# EAGLE design SKAARDUINO-SER_v1.0 (EAGLE 7.5.0)

## Sheet 1 of 2
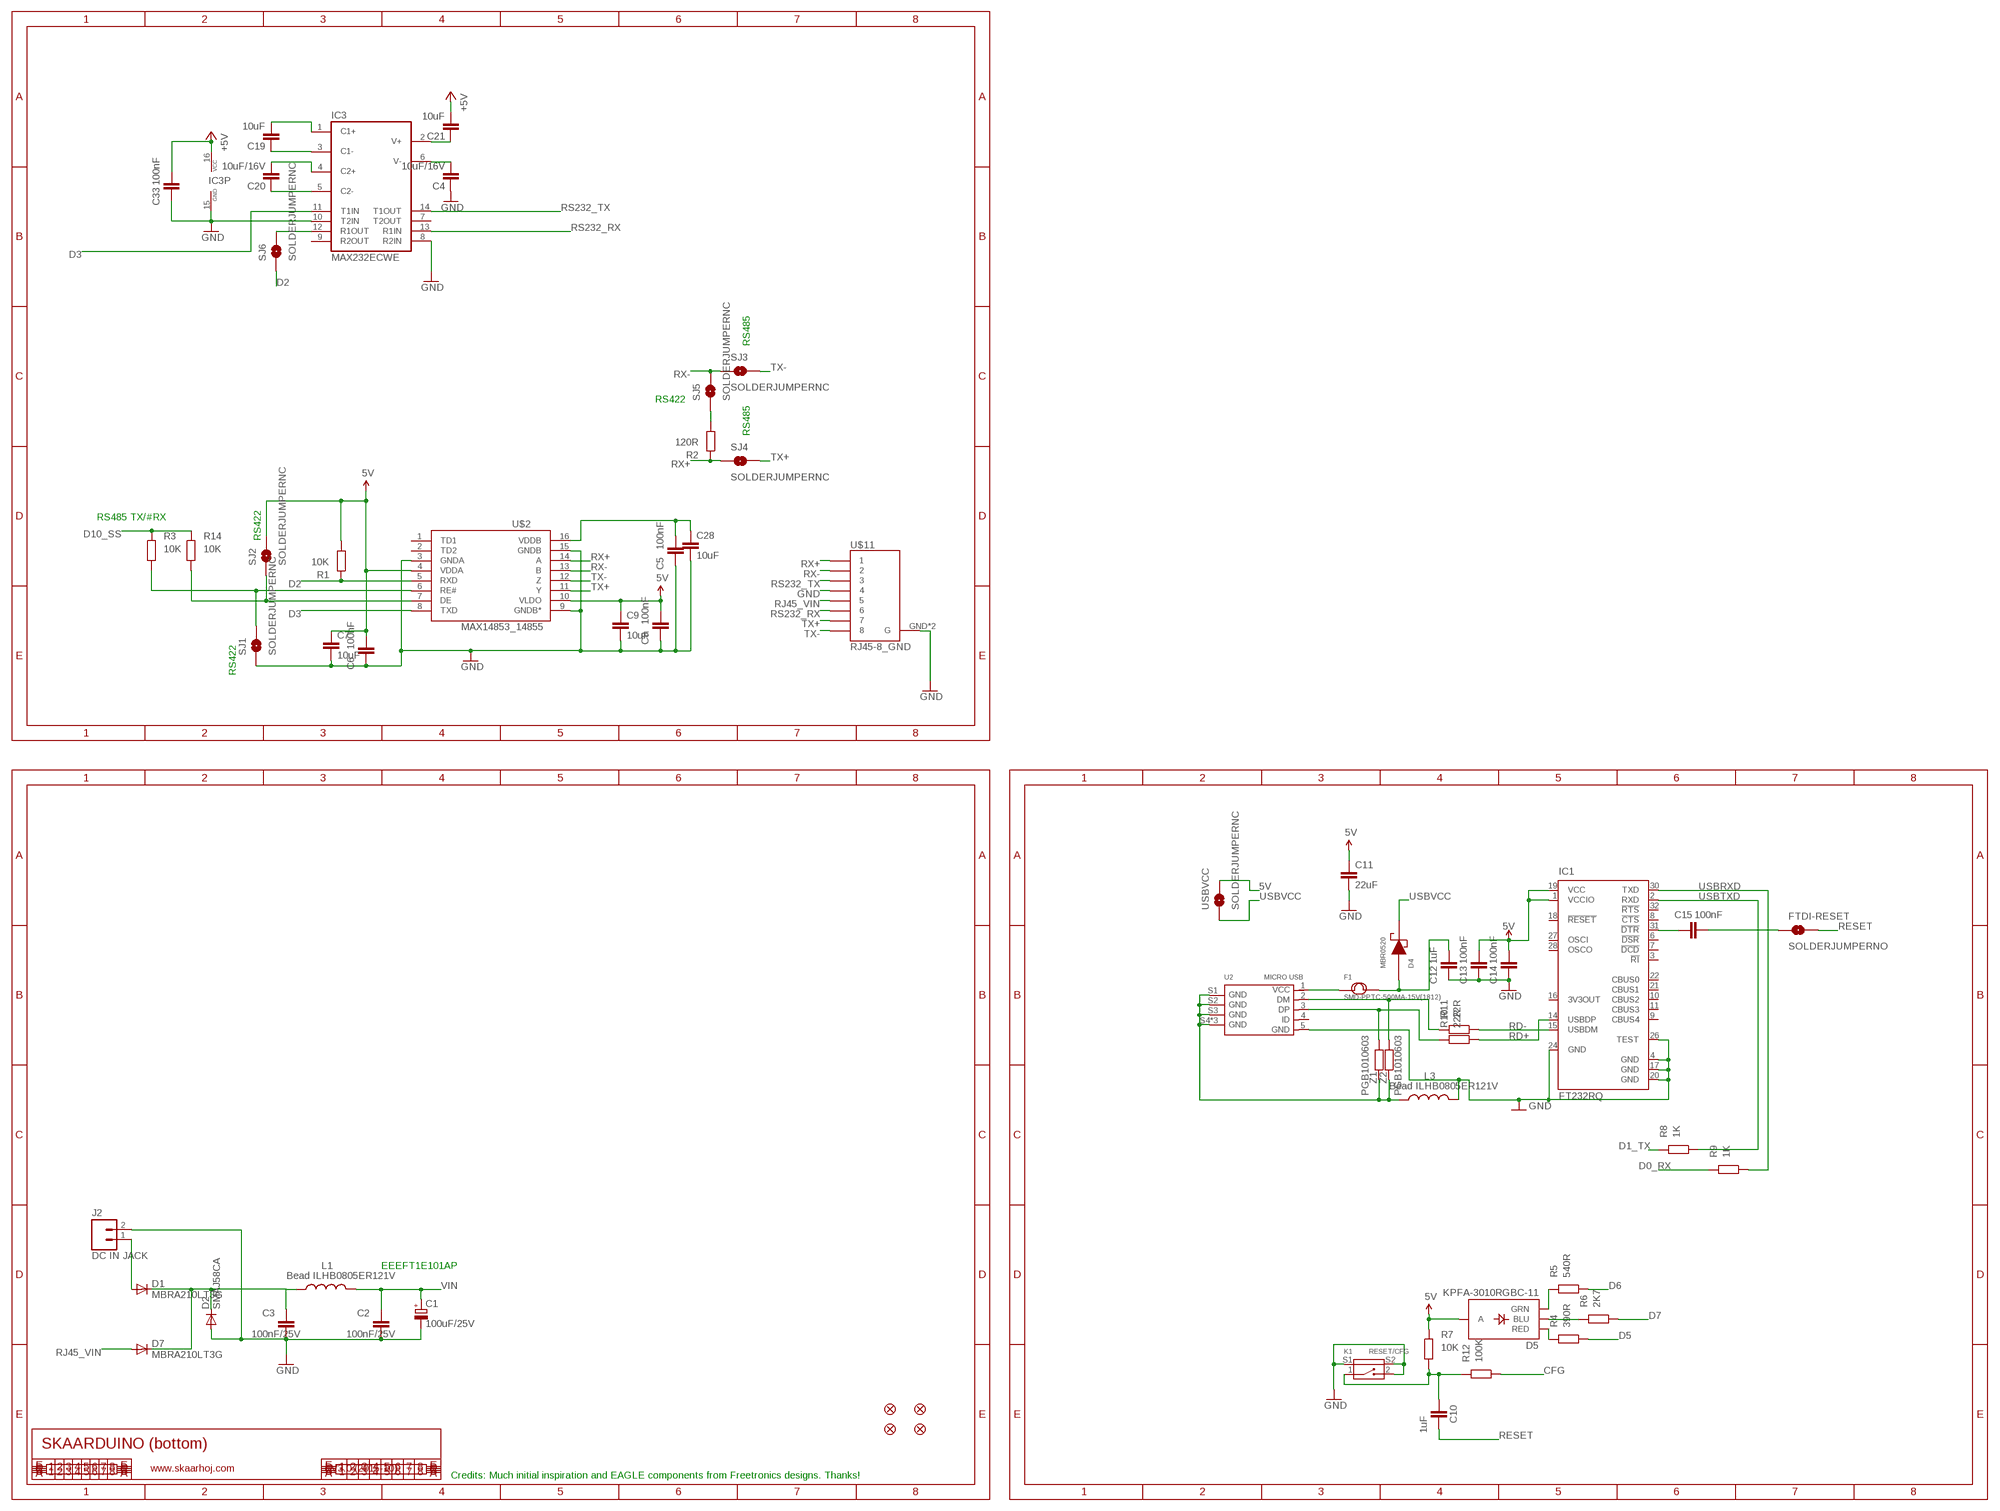
[diagram p0: schematic, sheet 1]

### Parts
C1  100uF/25V  CPOL-EUD  [PANASONIC_D]
C2  100nF/25V  CAP0402  [C0402]
C3  100nF/25V  CAP0402  [C0402]
C4  10uF/16V  CAP0805  [0805]
C5  100nF  C-EU0402C  [0402C]
C6  100nF  C-EU0402C  [0402C]
C7  10uF  CAP0805  [0805]
C8  100nF  C-EU0402C  [0402C]
C9  10uF  CAP0805  [0805]
C10  1uF  C-EU0402C  [0402C]
C11  22uF  CAP0805  [0805]
C12  1uF  C-EU0402C  [0402C]
C13  100nF  C-EU0402C  [0402C]
C14  100nF  C-EU0402C  [0402C]
C15  100nF  C-EU0402C  [0402C]
C19  10uF  CAP0805  [0805]
C20  10uF/16V  CAP0805  [0805]
C21  10uF  CAP0805  [0805]
C28  10uF  CAP0805  [0805]
C33  100nF  C-EU0402C  [0402C]
D1  MBRA210LT3G  DIODESMA  [SMA-DIODE]
D2  SMAJ58CA  DIODESMA  [SMA-DIODE]
D4  MBR0520  [SOD-123]
D5  KPFA-3010RGBC-11  LED-TRICOLOR  [LED-TRICOLOR-SMD]
D7  MBRA210LT3G  DIODESMA  [SMA-DIODE]
F1  SMD-PPTC-500MA-15V(1812)  [F1812]
FID1  FIDUCIAL1X2.5  [FIDUCIAL-1X2.5]
FID2  FIDUCIAL1X2.5  [FIDUCIAL-1X2.5]
FID3  FIDUCIAL1X2.5  [FIDUCIAL-1X2.5]
FID4  FIDUCIAL1X2.5  [FIDUCIAL-1X2.5]
FTDI-RESET  SOLDERJUMPERNO  [SJ_2S-NO]
IC1  FT232RQ  [QFN32]
IC3  MAX232ECWE  [SO16L]
J2  DC IN JACK  M02PTH  [1X02]
K1  RESET/CFG  SMD-BUTTON-2+2P  [SW4-SMD-7.0X3.5X3.5MM-90D]
L1  Bead ILHB0805ER121V  L-USL2012C  [L2012C]
L3  Bead ILHB0805ER121V  L-USL2012C  [L2012C]
R1  10K  RESISTOR0402  [0402]
R2  120R  RESISTOR0402  [0402]
R3  10K  RESISTOR0402  [0402]
R4  390R  RESISTOR0402  [0402]
R5  540R  RESISTOR0402  [0402]
R6  2K7  RESISTOR0402  [0402]
R7  10K  RESISTOR0402  [0402]
R8  1K  RESISTOR0402  [0402]
R9  1K  RESISTOR0402  [0402]
R10  22R  RESISTOR0402  [0402]
R11  22R  RESISTOR0402  [0402]
R12  100K  RESISTOR0402  [0402]
R14  10K  RESISTOR0402  [0402]
SJ1  SOLDERJUMPERNC  [SJ_2S]
SJ2  SOLDERJUMPERNC  [SJ_2S]
SJ3  SOLDERJUMPERNC  [SJ_2S]
SJ4  SOLDERJUMPERNC  [SJ_2S]
SJ5  SOLDERJUMPERNC  [SJ_2S]
SJ6  SOLDERJUMPERNC  [SJ_2S]
U2  MICRO USB  MICRO-USB-SMD-B-WITHOUT-POST-W/P(ST-USB-001G)  [MICRO-USB5+4P-SMD-0.65-B]
U$2  MAX14853_14855  [SO-16W]
U$11  RJ45-8_GND  [RJ45-8_GND]
USBVCC  SOLDERJUMPERNC  [SJ_2S]
Z1  PGB1010603  RESISTOR0402  [C0402]
Z2  PGB1010603  RESISTOR0402  [C0402]

### Nets
5V [power]: C6.2 C7.1 C8.2 C9.1 C11.1 C13.2 C14.2 C21.2 C33.2 D5.A IC1.1(VCCIO) IC1.19(VCC) IC3.16(VCC) R1.1 R7.2 SJ2.2 U$2.4(VDDA) U$2.10(VLDO) USBVCC.2 ; supply symbol labelled +5V ; also sheet 2
CFG: R12.1 ; also sheet 2
CFGSW: C10.2 K1.1 R7.1 R12.2
D0_RX: R9.2 ; also sheet 2
D1_TX: R8.2 ; also sheet 2
D2: R1.2 SJ6.1 U$2.5(RXD) ; also sheet 2
D3: IC3.11(T1IN) U$2.8(TXD) ; also sheet 2
D5: R4.1 ; also sheet 2
D6: R5.1 ; also sheet 2
D7: R6.1 ; also sheet 2
D10_SS: R3.2 R14.2 ; also sheet 2
GND [power]: C1.- C2.2 C3.2 C4.1 C5.1 C6.1 C7.2 C8.1 C9.2 C11.2 C12.1 C13.1 C14.1 C28.2 C33.1 D2.A IC1.4(GND) IC1.17(GND) IC1.20(GND) IC1.24(GND) IC1.26(TEST) IC3.8(R2IN) IC3.10(T2IN) IC3.15(GND) J2.2 K1.2 K1.S1 K1.S2 L3.2 SJ1.1 U2.5(GND) U$2.3(GNDA) U$2.9(GNDB*) U$2.15(GNDB) U$11.4 U$11.GND1(G) U$11.GND(G) ; also sheet 2
MAX232_V+ [power]: C21.1 IC3.2(V+)
N$1: C19.1 IC3.3(C1-)
N$2: C15.2 FTDI-RESET.1
N$3: D5.B(BLU) R6.2
N$4 [VIN]: C3.1 D1.C D2.C D7.C L1.1
N$5: D5.G(GRN) R5.2
N$6 [VIN]: C12.2 D4.2(AN) F1.2
N$7 [VIN]: F1.1 U2.1(VCC)
N$9: C20.1 IC3.5(C2-)
N$11: C20.2 IC3.4(C2+)
N$13 [VIN]: D1.A J2.1
N$15: D5.R(RED) R4.2
N$16: R10.2 U2.3(DP) Z1.1
N$17: R11.2 U2.2(DM) Z2.1
N$18: C15.1 IC1.31(!DTR)
N$20: IC3.12(R1OUT) SJ6.2
N$21: L3.1 U2.S1(GND) U2.S2(GND) U2.S3(GND) U2.S4(GND) U2.S5(GND) U2.S6(GND) Z1.2 Z2.2
N$30: R2.1 SJ5.1
N$31: R14.1 SJ2.1 U$2.7(DE)
N$32: R3.1 SJ1.2 U$2.6(RE#)
N$35: C5.2 C28.1 U$2.16(VDDB)
N$47: C19.2 IC3.1(C1+)
N$49 [power]: C4.2 IC3.6(V-)
RD+: IC1.14(USBDP) R10.1
RD-: IC1.15(USBDM) R11.1
RESET: C10.1 FTDI-RESET.2 ; also sheet 2
RJ45_VIN: D7.A U$11.5
RS232_RX: IC3.13(R1IN) U$11.6
RS232_TX: IC3.14(T1OUT) U$11.3
RX+: R2.2 SJ4.1 U$2.14(A) U$11.1
RX-: SJ3.1 SJ5.2 U$2.13(B) U$11.2
TX+: SJ4.2 U$2.11(Y) U$11.7
TX-: SJ3.2 U$2.12(Z) U$11.8
USBRXD: IC1.30(TXD) R9.1
USBTXD: IC1.2(RXD) R8.1
USBVCC [VIN]: D4.1(CA) USBVCC.1
VIN [VIN]: C1.+ C2.1 L1.2 ; also sheet 2
Unconnected: IC1.3(!RI) IC1.6(!DSR) IC1.7(!DCD) IC1.8(!CTS) IC1.9(CBUS4) IC1.10(CBUS2) IC1.11(CBUS3) IC1.16(3V3OUT) IC1.18(!RESET) IC1.21(CBUS1) IC1.22(CBUS0) IC1.27(OSCI) IC1.28(OSCO) IC1.32(!RTS) IC3.7(T2OUT) IC3.9(R2OUT) U2.4(ID) U$2.1(TD1) U$2.2(TD2)

### Notes on the sheet
- RS485
- RS422
- RS485
- RS485 TX/#RX
- RS422
- RS422
- EEEFT1E101AP
- SKAARDUINO (bottom)
- www.skaarhoj.com | V3.0 (2015-10)
- Credits: Much initial inspiration and EAGLE components from Freetronics designs. Thanks!

## Sheet 2 of 2
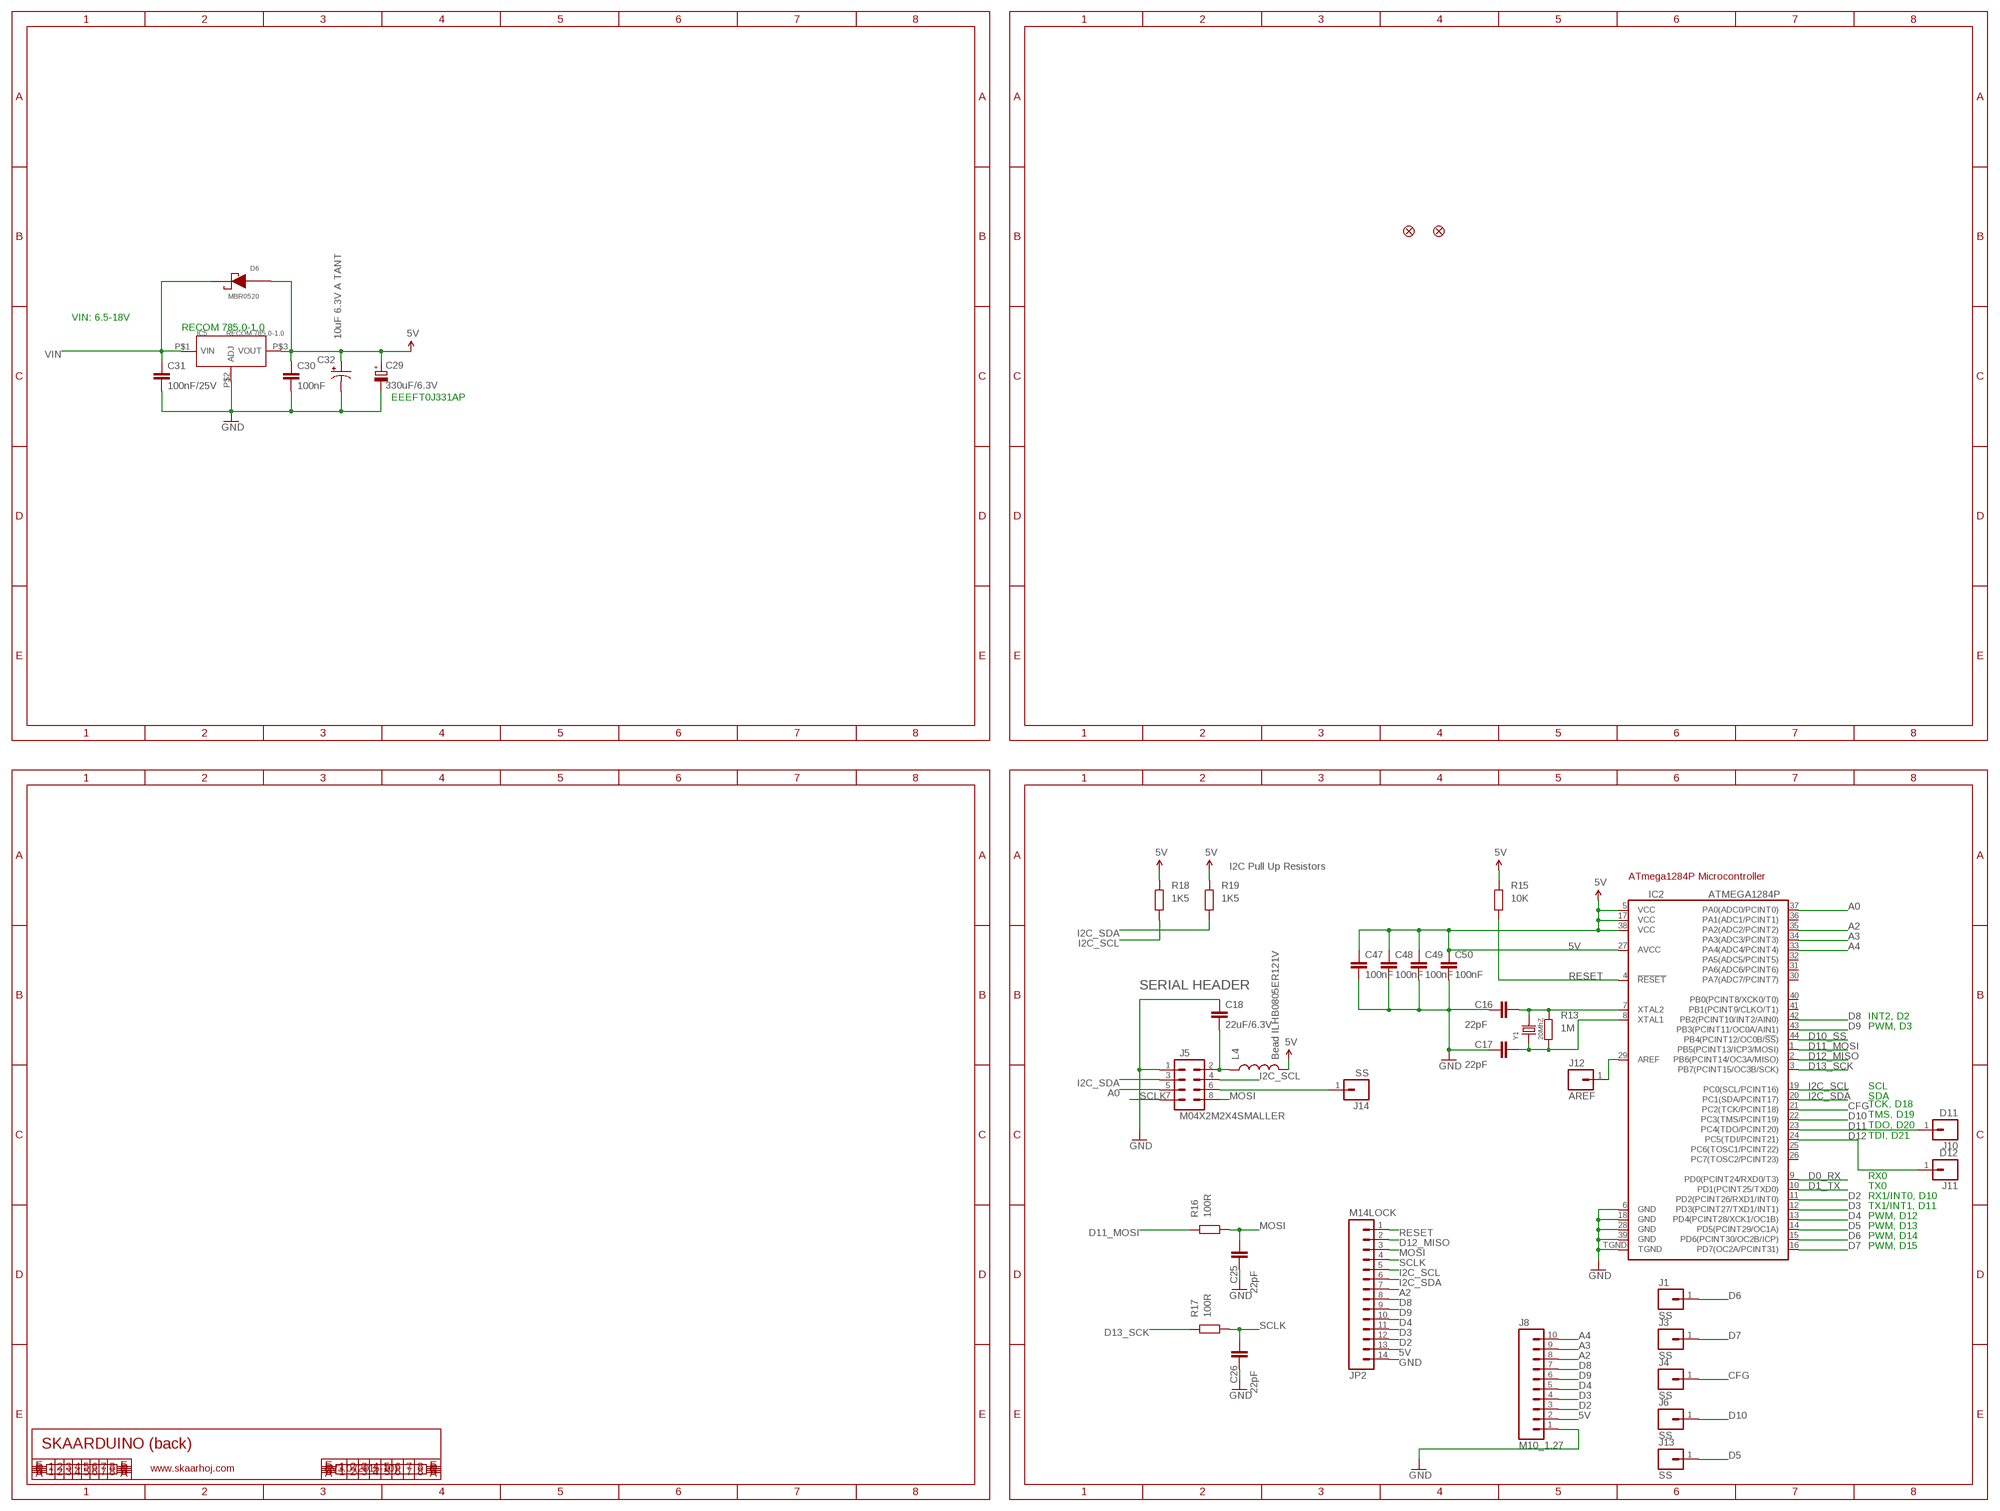
[diagram p1: schematic, sheet 2]

### Parts
C16  22pF  C-EU0402C  [0402C]
C17  22pF  C-EU0402C  [0402C]
C18  22uF/6.3V  CAP0805  [0805]
C25  22pF  C-EU0402C  [0402C]
C26  22pF  C-EU0402C  [0402C]
C29  330uF/6.3V  CPOL-EUD  [PANASONIC_D]
C30  100nF  C-EU0402C  [0402C]
C31  100nF/25V  C-EU0402C  [0402C]
C32  10uF 6.3V A TANT  CAP_POL1206  [EIA3216]
C47  100nF  C-EU0402C  [0402C]
C48  100nF  C-EU0402C  [0402C]
C49  100nF  C-EU0402C  [0402C]
C50  100nF  C-EU0402C  [0402C]
D6  MBR0520  [SOD-123]
FID5  FIDUCIAL1X2.5  [FIDUCIAL-1X2.5]
FID8  FIDUCIAL1X2.5  [FIDUCIAL-1X2.5]
IC2  ATMEGA1284P  [QFN-44M1]
IC5  RECOM 785.0-1.0  PMIC-LM317EMP  [RECOM_785.0-1.0]
J1  SS  M1X1TEST  [M1X1]
J3  SS  M1X1TEST  [M1X1]
J4  SS  M1X1TEST  [M1X1]
J5  M04X2M2X4SMALLER  [M2X4SMALLER]
J6  SS  M1X1TEST  [M1X1]
J8  M10_1.27  [M10X1]
J10  D11  M1X1TEST  [M1X1]
J11  D12  M1X1TEST  [M1X1]
J12  AREF  M1X1TEST  [M1X1]
J13  SS  M1X1TEST  [M1X1]
J14  SS  M1X1TEST  [M1X1]
JP2  M14LOCK  [1X14_LOCK]
L4  Bead ILHB0805ER121V  INDUCTOR0805  [0805]
R13  1M  RESISTOR0402  [0402]
R15  10K  RESISTOR0402  [0402]
R16  100R  RESISTOR0402  [0402]
R17  100R  RESISTOR0402  [0402]
R18  1K5  RESISTOR0402  [0402]
R19  1K5  RESISTOR0402  [0402]
Y1  20MhZ  SMD-CRYSTAL-16MHZ-8PF-20PPM-40R(2P-5.0X3.2MM)  [X2-SMD-5.0X3.2X1.3MM]

### Nets
5V [power]: C29.+ C30.1 C32.A(+) C47.1 C48.1 C49.1 C50.1 D6.2(AN) IC2.5(VCC) IC2.17(VCC) IC2.27(AVCC) IC2.38(VCC) IC5.P$3(VOUT) J8.2 JP2.13 L4.2 R15.2 R18.2 R19.2 ; also sheet 1
A0: IC2.37(PA0(ADC0/PCINT0)) J5.5
A2: IC2.35(PA2(ADC2/PCINT2)) J8.8 JP2.7
A3: IC2.34(PA3(ADC3/PCINT3)) J8.9
A4: IC2.33(PA4(ADC4/PCINT4)) J8.10
CFG: IC2.21(PC2(TCK/PCINT18)) J4.1 ; also sheet 1
D0_RX: IC2.9(PD0(PCINT24/RXD0/T3)) ; also sheet 1
D1_TX: IC2.10(PD1(PCINT25/TXD0)) ; also sheet 1
D2: IC2.11(PD2(PCINT26/RXD1/INT0)) J8.3 JP2.12 ; also sheet 1
D3: IC2.12(PD3(PCINT27/TXD1/INT1)) J8.4 JP2.11 ; also sheet 1
D4: IC2.13(PD4(PCINT28/XCK1/OC1B)) J8.5 JP2.10
D5: IC2.14(PD5(PCINT29/OC1A)) J13.1 ; also sheet 1
D6: IC2.15(PD6(PCINT30/OC2B/ICP)) J1.1 ; also sheet 1
D7: IC2.16(PD7(OC2A/PCINT31)) J3.1 ; also sheet 1
D8: IC2.42(PB2(PCINT10/INT2/AIN0)) J8.7 JP2.8
D9: IC2.43(PB3(PCINT11/OC0A/AIN1)) J8.6 JP2.9
D10: IC2.22(PC3(TMS/PCINT19)) J6.1
D10_SS: IC2.44(PB4(PCINT12/OC0B/!SS!)) ; also sheet 1
D11: IC2.23(PC4(TDO/PCINT20)) J10.1
D11_MOSI: IC2.1(PB5(PCINT13/ICP3/MOSI)) R16.2
D12: IC2.24(PC5(TDI/PCINT21)) J11.1
D12_MISO: IC2.2(PB6(PCINT14/OC3A/MISO)) JP2.2
D13_SCK: IC2.3(PB7(PCINT15/OC3B/SCK)) R17.2
GND [power]: C16.1 C17.1 C18.1 C25.1 C26.1 C29.- C30.2 C31.2 C32.C(-) C47.2 C48.2 C49.2 C50.2 IC2.6(GND) IC2.18(GND) IC2.28(GND) IC2.39(GND) IC2.TGND IC5.P$2(ADJ) J5.1 J8.1 JP2.14 ; also sheet 1
I2C_SCL: IC2.19(PC0(SCL/PCINT16)) J5.4 JP2.5 R18.1
I2C_SDA: IC2.20(PC1(SDA/PCINT17)) J5.3 JP2.6 R19.1
MOSI: C25.2 J5.8 JP2.3 R16.1
N$8: C16.2 IC2.7(XTAL2) R13.2 Y1.2
N$10: J5.6 J14.1
N$12: C17.2 IC2.8(XTAL1) R13.1 Y1.1
N$19 [power]: C18.2 J5.2 L4.1
N$25: IC2.29(AREF) J12.1
RESET: IC2.4(!RESET) JP2.1 R15.1 ; also sheet 1
SCLK: C26.2 J5.7 JP2.4 R17.1
VIN [VIN]: C31.1 D6.1(CA) IC5.P$1(VIN) ; also sheet 1
Unconnected: IC2.25(PC6(TOSC1/PCINT22)) IC2.26(PC7(TOSC2/PCINT23)) IC2.30(PA7(ADC7/PCINT7)) IC2.31(PA6(ADC6/PCINT6)) IC2.32(PA5(ADC5/PCINT5)) IC2.36(PA1(ADC1/PCINT1)) IC2.40(PB0(PCINT8/XCK0/T0)) IC2.41(PB1(PCINT9/CLKO/T1))

### Notes on the sheet
- VIN: 6.5-18V
- RECOM 785.0-1.0
- EEEFT0J331AP
- I2C Pull Up Resistors
- ATmega1284P Microcontroller
- SERIAL HEADER
- INT2, D2
- PWM, D3
- SCL
- SDA
- TCK, D18
  TMS, D19
  TDO, D20
  TDI, D21
- RX0
- TX0
- RX1/INT0, D10
- TX1/INT1, D11
- PWM, D12
- PWM, D13
- PWM, D14
- PWM, D15
- SKAARDUINO (back)
- www.skaarhoj.com | V3.0 (2015-10)

## Library data of the parts
C1 C29 = rcl:CPOL-EU: POLARIZED CAPACITOR, European symbol
C2 C3 = freetronics:CAP: Capacitor Standard 0603 ceramic capacitor, and 0.1" leaded capacitor.
C4 C7 C9 C11 C18-C21 C28 = SparkFun:CAP: Capacitor Standard 0603 ceramic capacitor, and 0.1" leaded capacitor.
C5 C6 C8 C10 C12-C17 C25 C26 C30 C31 C33 C47-C50 = freetronics-jon:C-EU: CAPACITOR, European symbol
C32 = freetronics:CAP_POL: Capacitor Polarized These are standard SMD and PTH capacitors. Normally 10uF, 47uF, and 100uF in electrolytic and tantalum varieties. Always verify the external diameter of the through hole cap, it varies with capacity, voltage, and manufacturer. The EIA devices should be standard.
D1 D2 D7 = SparkFun:DIODE: Diode These are standard reverse protection diodes and small signal diodes. SMA package can handle up to about 1A. SOD-323 can handle about 200mA. What the SOD-323 package when ordering, there are some mfgs out there that are 5-pin packages.
D4 D6 = MySMD:MBR0520
D5 = SKAARHOJ:LED-TRICOLOR: Tri-Color LED SMD Proven layout and schematic for triple color LED in SMD package - common anode. Spark Fun Electronics SKU : COM-07844
F1 = Seeed-OPL-fuse:SMD-PPTC-500MA-15V(1812): 307010007
FID1-FID5 FID8 = freetronics:FIDUCIAL: Fiducial Alignment Points Various fiducial points for machine vision alignment.
FTDI-RESET SJ1-SJ6 USBVCC = SparkFun:SOLDERJUMPER: Solder Jumper Standard SMD solder jumper. Used to automate production. Two varients : Normally Open and Normally Closed are the same, but have different paste layers. NC will have a large amount of paste and should jumper during reflow.
IC1 = ftdichip:FT232R: Source: http://www.ftdichip.com/Documents/DataSheets/DS_FT232R_v104.pdf; MPN: FT232RQ; OC_FARNELL: 1146033; OC_NEWARK: 91K9919
IC2 = freetronics-jon:ATMEGA1284P
IC3 = maxim:MAX232ECWE: RS232 TRANSCEIVER; MF: MAXIM; MPN: MAX232ECWE+; OC_FARNELL: 9724435; OC_NEWARK: 67K4440
IC5 = SKAARHOJ:PMIC-LM317EMP: 3-Terminal Adjustable Regulator
J1 J3 J4 J6 J10-J14 = SKAARHOJ:M1X1
J2 = SparkFun:M02: Header 2 Standard 2-pin 0.1" header. Use with straight break away headers (SKU : PRT-00116), right angle break away headers (PRT-00553), swiss pins (PRT-00743), machine pins (PRT-00117), and female headers (PRT-00115). Molex polarized connector foot print use with SKU : PRT-08233 with associated crimp pins and housings.
J5 = SKAARHOJ:M04X2
J8 = SKAARHOJ:M10_1.27
JP2 = SKAARHOJ:M14: Header 14 Standard 14-pin 0.1" header. Use with straight break away headers (SKU : PRT-00116), right angle break away headers (PRT-00553), swiss pins (PRT-00743), machine pins (PRT-00117), and female headers (PRT-00115).
K1 = Seeed-OPL-Button:SMD-BUTTON-2+2P: 311020023; MPN: TS-1188E
L1 L3 = rcl:L-US: INDUCTOR, American symbol
L4 = SparkFun:INDUCTOR: Inductors Basic Inductor/Choke - 0603 and 1206. Footprints are not proven and vary greatly between part numbers.
R1-R19 = freetronics-jon:RESISTOR: Resistor Basic schematic elements and footprints for 0603, 1206, and PTH 1/10th watt (small) resistors.
U2 = Seeed-OPL-Connector:MICRO-USB-SMD-B-WITHOUT-POST-W/P(ST-USB-001G): 320010000; MPN: ST-USB-001G
U$2 = SKAARHOJ:MAX14853_14855
U$11 = SKAARHOJ:RJ45-8_GND
Y1 = Seeed-OPL-crystal-osctllator:SMD-CRYSTAL-16MHZ-8PF-20PPM-40R(2P-5.0X3.2MM): 306010054; MPN: X053201602002
Z1 Z2 = freetronics:RESISTOR: Resistor Basic schematic elements and footprints for 0603, 1206, and PTH 1/10th watt (small) resistors.

## Net classes
0 default: width 0.203 mm, clearance 0.127 mm
1 power: width 0.203 mm, clearance 0.127 mm
2 VIN: width 0.406 mm, clearance 0.61 mm

## Board
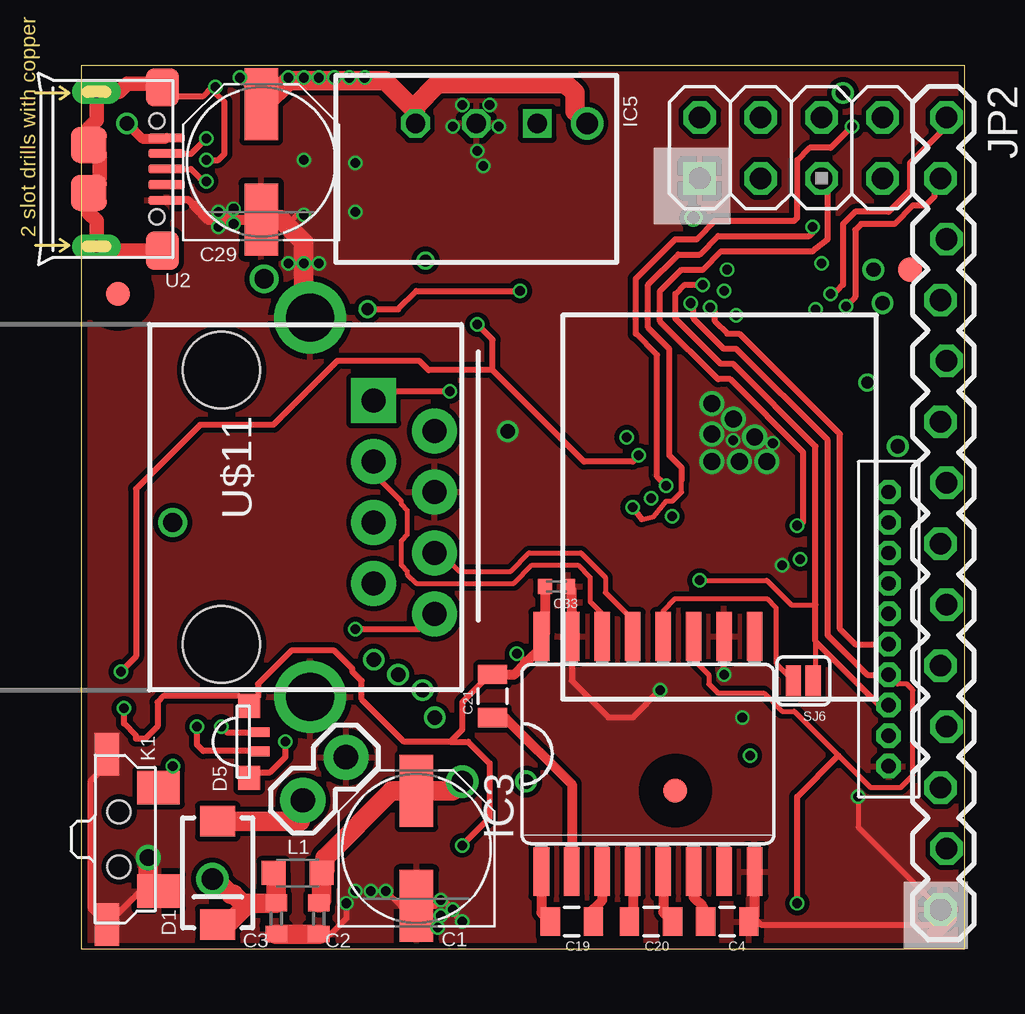
[diagram p2: board, top side]
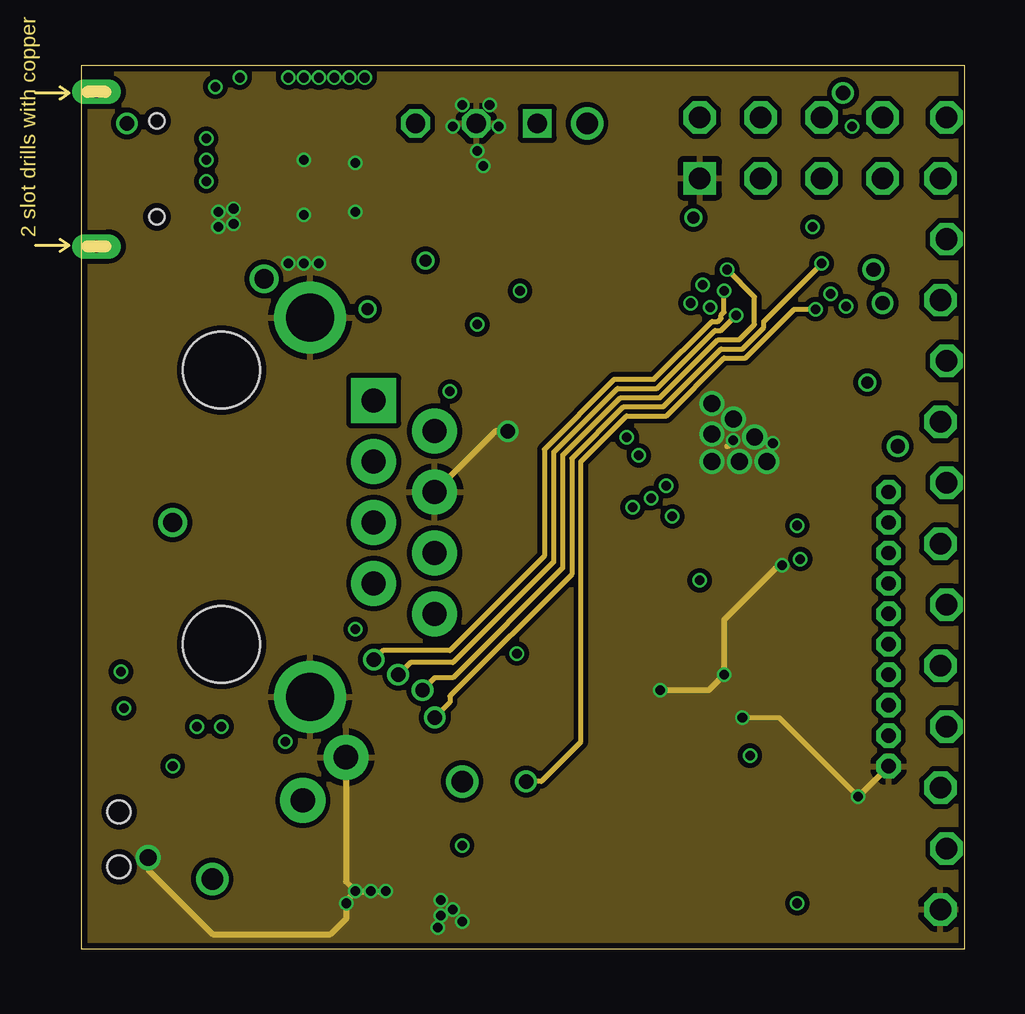
[diagram p3: board, inner layer GND]
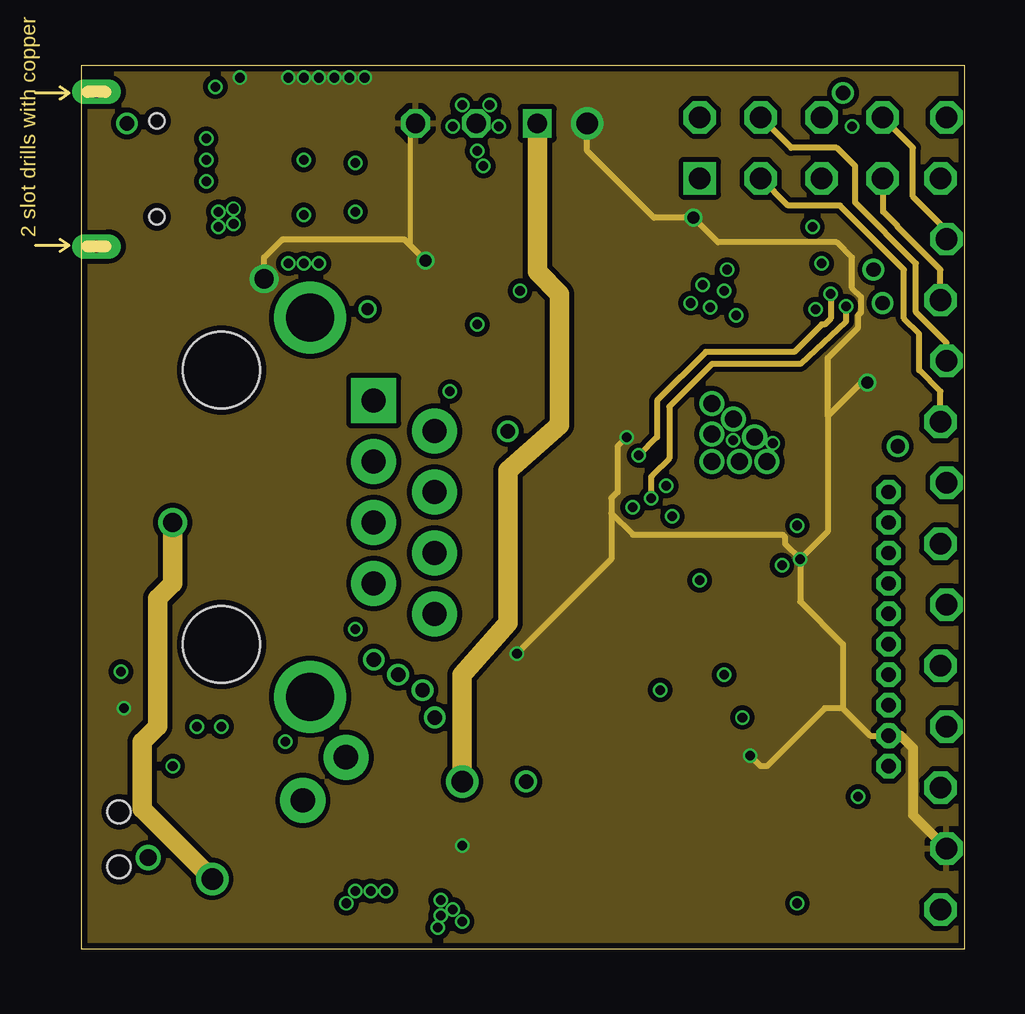
[diagram p4: board, inner layer 5V]
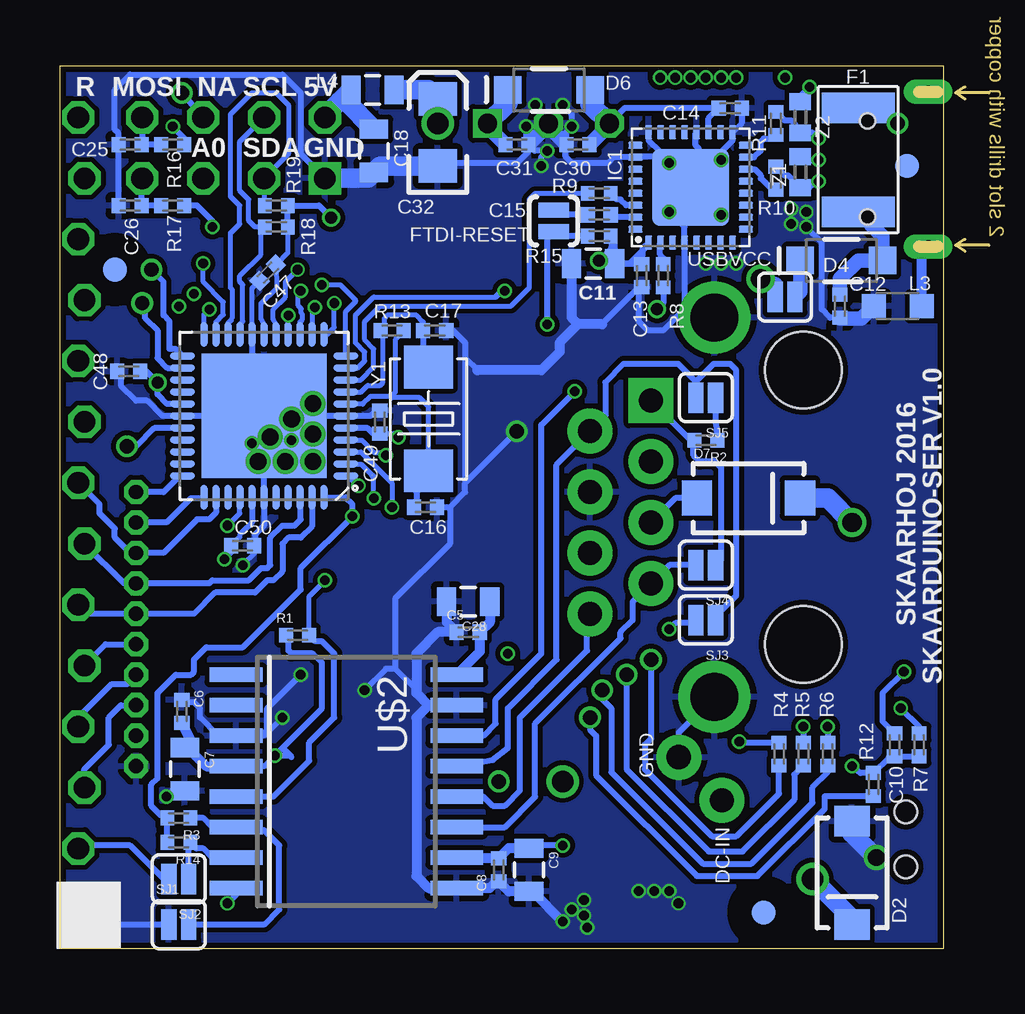
[diagram p5: board, bottom side, seen from below]

Size 36.83 x 36.83 mm. Coordinates in mm from the lower left corner, seen from the top.
Outline: 0,0 36.83,0 36.83,36.83 0,36.83 0,0
Copper layers (1*2*15*16): Top 0.035mm / dielectric 0.2mm / GND 0.0175mm / dielectric 0.3mm / 5V 0.0175mm / dielectric 0.2mm / Bottom 0.035mm
Design rules "SeeedStudio_4layer_DRU_no_angle_20140221 *": minimum track width 8mil, minimum drill 12mil, track to track 8mil, track to pad 8mil, pad to pad 8mil, via to via 8mil, smd to smd 0mil, copper to edge 10mil, drill to drill 8mil, minimum pad ring 6mil, minimum via ring 4mil, stop-mask expansion 4mil, vias tented up to drill 100mil, thermal gap 10mil
tKeepout: area 19.7,0 to 23,36.8
tRestrict: area 0.5,26.3 to 2.5,28.3; area 33.5,27.3 to 35.6,29.3; area 23.7,5.6 to 25.8,7.6
bRestrict: area 6.5,0.5 to 8.5,2.5; area 0.5,31.6 to 2.5,33.7; area 33.5,27.3 to 35.6,29.3

### Footprints (pad centres in the part's own frame; a part is rotated, then mirrored left to right if it is on the bottom)
PANASONIC_D = smd 3 x 1.4: + 2.4,0; - -2.4,0
C0402 = smd 0.7 x 0.9: 1 -0.65,0; 2 0.65,0
0805 = smd 0.8 x 1.2: 1 -0.9,0; 2 0.9,0
0402C = smd 0.59 x 0.64: 1 -0.48,0; 2 0.48,0
EIA3216 = smd 1.4 x 1.6: A 1.4,0; C -1.4,0
SMA-DIODE = smd 1.27 x 1.47: A -2.15,0; C 2.15,0
SOD-123 = smd 1.143 x 1.143: 1 0,0; 2 3.429,0
LED-TRICOLOR-SMD = smd 1 x 0.9: A -1.5,0; R 1.5,0 | smd 0.4 x 0.8: B 0.4,0.45; G -0.4,0.45
F1812 = smd 1.27 x 3.048: 1 -2.159,0; 2 2.159,0
FIDUCIAL-1X2.5 = smd 1 x 1: 1 0,0
SJ_2S-NO = smd 0.635 x 1.27: 1 -0.45,0; 2 0.45,0
QFN32 = smd 0.6 x 0.3: 1 -2.3,1.75; 2 -2.3,1.25; 3 -2.3,0.75; 4 -2.3,0.25; 5 -2.3,-0.25; 6 -2.3,-0.75; 7 -2.3,-1.25; 8 -2.3,-1.75; 17 2.3,-1.75; 18 2.3,-1.25; 19 2.3,-0.75; 20 2.3,-0.25; 21 2.3,0.25; 22 2.3,0.75; 23 2.3,1.25; 24 2.3,1.75 | smd 0.3 x 0.6: 9 -1.75,-2.3; 10 -1.25,-2.3; 11 -0.75,-2.3; 12 -0.25,-2.3; 13 0.25,-2.3; 14 0.75,-2.3; 15 1.25,-2.3; 16 1.75,-2.3; 25 1.75,2.3; 26 1.25,2.3; 27 0.75,2.3; 28 0.25,2.3; 29 -0.25,2.3; 30 -0.75,2.3; 31 -1.25,2.3; 32 -1.75,2.3 | smd 3.2 x 3.2: EXP 0,0
QFN-44M1 = smd 0.3 x 1.05: 1 -2.5,-3.4; 2 -2,-3.4; 3 -1.5,-3.4; 4 -1,-3.4; 5 -0.5,-3.4; 6 0,-3.4; 7 0.5,-3.4; 8 1,-3.4; 9 1.5,-3.4; 10 2,-3.4; 11 2.5,-3.4; 23 2.5,3.4; 24 2,3.4; 25 1.5,3.4; 26 1,3.4; 27 0.5,3.4; 28 0,3.4; 29 -0.5,3.4; 30 -1,3.4; 31 -1.5,3.4; 32 -2,3.4; 33 -2.5,3.4 | smd 1.05 x 0.3: 12 3.4,-2.5; 13 3.4,-2; 14 3.4,-1.5; 15 3.4,-1; 16 3.4,-0.5; 17 3.4,0; 18 3.4,0.5; 19 3.4,1; 20 3.4,1.5; 21 3.4,2; 22 3.4,2.5; 34 -3.4,2.5; 35 -3.4,2; 36 -3.4,1.5; 37 -3.4,1; 38 -3.4,0.5; 39 -3.4,0; 40 -3.4,-0.5; 41 -3.4,-1; 42 -3.4,-1.5; 43 -3.4,-2; 44 -3.4,-2.5 | smd 5.2 x 5.2: TGND 0,0
SO16L = smd 0.66 x 2.032: 1 -4.445,-4.902; 2 -3.175,-4.902; 3 -1.905,-4.902; 4 -0.635,-4.902; 5 0.635,-4.902; 6 1.905,-4.902; 7 3.175,-4.902; 8 4.445,-4.902; 9 4.445,4.902; 10 3.175,4.902; 11 1.905,4.902; 12 0.635,4.902; 13 -0.635,4.902; 14 -1.905,4.902; 15 -3.175,4.902; 16 -4.445,4.902
RECOM_785.0-1.0 = drill 0.8 square: P$1 -2.54,0 | drill 0.8 octagon: P$2 0,0; P$3 2.54,0
M1X1 = drill 0.6 pad 0.813: 1 0,0
1X02 = drill 1.016 pad 1.88: 1 0,0; 2 2.54,0
M2X4SMALLER = drill 0.9 square: 1 -1.27,3.81 | drill 0.9 octagon: 2 1.27,3.81; 3 -1.27,1.27; 4 1.27,1.27; 5 -1.27,-1.27; 6 1.27,-1.27; 7 -1.27,-3.81; 8 1.27,-3.81
M10X1 = drill 0.6 pad 1.016 octagon: 1 0,0; 2 0,1.27; 3 0,2.54; 4 0,3.81; 5 0,5.08; 6 0,6.35; 7 0,7.62; 8 0,8.89; 9 0,10.16; 10 0,11.43
1X14_LOCK = drill 0.9 octagon: 1 0,0.127; 2 2.54,-0.127; 3 5.08,0.127; 4 7.62,-0.127; 5 10.16,0.127; 6 12.7,-0.127; 7 15.24,0.127; 8 17.78,-0.127; 9 20.32,0.127; 10 22.86,-0.127; 11 25.4,0.127; 12 27.94,-0.127; 13 30.48,0.127; 14 33.02,-0.127
SW4-SMD-7.0X3.5X3.5MM-90D = smd 1.397 x 1.778: 1 -2.159,1.651; 2 2.159,1.651 | smd 1.778 x 1.016: S1 -3.556,-0.508; S2 3.556,-0.508 | hole 0.95: -1.15,0; 1.15,0
L2012C = smd 1 x 1: 1 -1,0; 2 1,0
0402 = smd 0.571 x 0.62: 1 -0.48,0; 2 0.48,0
SJ_2S = smd 0.635 x 1.27: 1 -0.412,0; 2 0.412,0
MICRO-USB5+4P-SMD-0.65-B = smd 0.381 x 1.524: 1 -1.3,-0.25; 2 -0.65,-0.25; 3 0,-0.25; 4 0.65,-0.25; 5 1.3,-0.25 | smd 1.6 x 1.397: S1 -3.4,-0.427; S6 3.4,-0.427 | drill 0.508 pad 1.016 long: S2 -3.226,-3.175; S5 3.226,-3.175 | smd 1.5 x 1.5: S3 -1,-3.5; S4 1,-3.5 | hole 0.635: -2,-0.65; 2,-0.65
SO-16W = smd 0.6 x 2.2: 1 -4.445,-4.6; 2 -3.175,-4.6; 3 -1.905,-4.6; 4 -0.635,-4.6; 5 0.635,-4.6; 6 1.905,-4.6; 7 3.175,-4.6; 8 4.445,-4.6; 9 4.445,4.6; 10 3.175,4.6; 11 1.905,4.6; 12 0.635,4.6; 13 -0.635,4.6; 14 -1.905,4.6; 15 -3.175,4.6; 16 -4.445,4.6
RJ45-8_GND = drill 1 pad 1.88 square: 1 -4.445,6.35 | drill 1 pad 1.88: 2 -3.175,8.89; 3 -1.905,6.35; 4 -0.635,8.89; 5 0.635,6.35; 6 1.905,8.89; 7 3.175,6.35; 8 4.445,8.89 | drill 2: GND -7.9,3.7; GND1 7.9,3.7 | hole 3.2: -5.715,0; 5.715,0
X2-SMD-5.0X3.2X1.3MM = smd 1.778 x 2.032: 1 -2.159,0; 2 2.159,0

### Placement (x,y rotation side)
C1  13.97,4.19 90 top
C2  9.91,1.27 270 top
C3  8.13,1.27 270 top
C4  26.92,1.14 180 top
C5  19.81,13.21 0 bottom
C6  31.75,9.91 270 bottom
C7  31.62,7.49 270 bottom
C8  18.54,3.3 90 bottom
C9  17.27,3.3 270 bottom
C10  2.03,8.51 270 bottom
C11  14.61,28.57 180 bottom
C12  4.32,26.8 90 bottom
C13  12.57,28.07 90 bottom
C14  8.89,35.05 180 bottom
C15  14.35,30.61 180 bottom
C16  21.59,18.41 180 bottom
C17  21.21,25.78 180 bottom
C18  23.75,33.27 90 bottom
C19  20.45,1.14 180 top
C20  23.75,1.14 180 top
C21  17.14,10.54 90 top
C25  33.91,33.53 0 bottom
C26  33.91,30.99 0 bottom
C28  19.81,14.48 180 bottom
C29  7.5,32.81 90 top
C30  15.24,33.53 180 bottom
C31  17.78,33.53 0 bottom
C32  21.08,34.04 90 bottom
C33  19.81,15.11 180 top
C47  28.17,28.19 225 bottom
C48  33.96,24.08 180 bottom
C49  23.5,21.97 90 bottom
C50  29.21,16.81 0 bottom
D1  5.68,3.17 270 top
D2  3.81,3.17 270 bottom
D4  5.97,28.7 0 bottom
D5  7,8.64 270 top
D6  18.16,35.81 0 bottom
D7  8.13,18.8 0 bottom
F1  3.56,32.89 270 bottom
FID1  1.52,27.3 0 top
FID2  1.52,32.64 0 bottom
FID3  34.54,28.32 0 top
FID4  7.49,1.52 0 bottom
FID5  24.77,6.6 0 top
FID8  34.54,28.32 0 bottom
FTDI-RESET  16.26,30.35 270 bottom
IC1  10.54,31.75 90 bottom
IC2  28.32,22.23 90 bottom
IC3  23.62,8.13 0 top
IC5  16.47,34.42 180 top
J1  13.21,11.43 0 top
J2  9.24,6.2 45 top
J3  14.22,10.79 0 top
J4  14.73,9.65 0 top
J5  29.59,33.4 90 top
J6  18.54,6.99 0 top
J8  33.66,7.62 0 top
J10  33.02,28.32 0 top
J11  33.4,26.92 0 top
J12  34.04,20.95 0 top
J13  12.19,12.06 0 top
J14  31.75,35.69 0 top
JP2  35.94,34.67 270 top
K1  1.57,4.57 270 top
L1  9.02,3.17 0 top
L3  1.91,26.8 180 bottom
L4  23.8,35.81 0 bottom
R1  26.92,13.08 0 bottom
R2  9.91,21.21 180 bottom
R3  31.88,5.46 180 bottom
R4  6.86,8.13 90 bottom
R5  5.84,8.13 90 bottom
R6  4.83,8.13 90 bottom
R7  1.02,8.51 90 bottom
R8  11.68,28.07 270 bottom
R9  14.35,31.5 180 bottom
R10  6.99,32.13 90 bottom
R11  6.99,34.42 90 bottom
R12  2.92,6.86 90 bottom
R13  22.99,25.78 0 bottom
R14  31.88,4.45 180 bottom
R15  14.35,29.72 0 bottom
R16  32.13,33.53 0 bottom
R17  32.13,30.99 0 bottom
R18  27.81,30.1 0 bottom
R19  27.81,30.99 0 bottom
SJ1  31.88,1.02 0 bottom
SJ2  31.88,2.92 180 bottom
SJ3  9.91,13.72 180 bottom
SJ4  9.91,16 180 bottom
SJ5  9.91,22.99 180 bottom
SJ6  30.1,11.18 180 top
U2  3.81,32.51 270 top
U$2  24.89,6.99 270 bottom
U$11  5.84,18.41 270 top
USBVCC  6.6,27.18 180 bottom
Y1  21.46,22.1 270 bottom
Z1  5.97,32.38 90 bottom
Z2  5.97,34.67 90 bottom

### Tracks (layer width: path | path; a pad name or v marks a point on that pad's centre or on a via)
5V  (via drill 0.4, 0.5, 0.8, 0.9)
  Top 0.254: v1.78,10.03 1.78,9.4 2.29,8.89 2.29,8.76 2.67,8.76 3.17,9.27 3.17,10.29 3.43,10.54 6.59,10.54 D5.A 7.37,10.5 7.37,11.05 8.76,12.45 10.54,12.45 11.3,11.68 11.3,11.56 11.68,11.18 11.68,10.41 13.46,8.64 15.37,8.64 | C21.2 17.03,11.44 15.88,10.29 15.88,9.14 15.37,8.64 | C29.+ 7.5,35.42 v6.6,36.32 | 8.64,36.2 v8.64,36.32 v9.27,36.32 v9.91,36.32 v10.54,36.32 v11.18,36.32 v11.81,36.32 | v18.16,12.32 18.54,11.94 | 15.37,8.64 16.13,8.64 17.02,7.75 17.02,5.46 v15.88,4.32
  Top 0.406: C21.2 17.16,11.43 18.03,11.43 18.54,11.94 19.18,12.57 IC3.16 19.33,13.19 C33.2
  Top 0.813: v21.08,34.42 20.57,34.92 20.57,35.69 20.19,36.07 14.86,36.07 13.93,35.14 13.93,34.92 | 13.93,34.92 IC5.P$3 | C29.+ 7.65,35.21 8.64,36.2 12.66,36.2 13.93,34.92
  5V 0.203: v14.35,28.7 13.72,29.34 13.72,34.2 IC5.P$3
  5V 0.254: v21.08,34.42 21.08,33.27 23.88,30.48 v25.53,30.48 26.54,29.46 31.5,29.46 32.13,28.83 32.13,27.56 32.51,27.18 32.51,26.54 32.38,26.42 32.38,25.91 31.11,24.64 31.11,22.23 | v29.97,16.26 29.97,14.48 31.75,12.7 31.75,10.03 | v22.73,21.34 22.35,20.95 22.35,19.05 22.1,18.8 22.1,18.16 | 22.1,18.16 22.99,17.27 29.23,17.27 29.34,17.17 29.34,16.89 v29.97,16.26 | v32.77,23.62 32.51,23.62 31.11,22.23 | 31.11,22.23 31.11,17.4 v29.97,16.26 | 31.75,10.03 32.89,8.89 J8.2 | v7.62,27.94 7.62,28.83 8.38,29.59 13.46,29.59 v14.35,28.7 | 31.75,10.03 30.99,10.03 28.57,7.62 28.32,7.62 v27.88,8.06 | 22.1,18.16 22.1,16.26 v18.16,12.32
  5V 0.406: J8.2 34.16,8.89 34.67,8.38 34.67,5.59 JP2.13
  Bottom 0.203: IC2.17 28.32,26.04 28.45,26.26 28.45,26.92 27.8,27.54 C47.1 27.33,29.03 R18.2 | R15.2 13.87,29.24 13.84,29.21 v14.35,28.7 | 29.21,17.4 29.34,17.27 29.34,17.17 C50.1 29.69,16.54 v29.97,16.26 | C49.1 22.89,21.49 v22.73,21.34
  Bottom 0.254: R7.2 1.02,9.27 v1.78,10.03 | C11.1 13.68,28.55 C13.2 12.54,29.21 IC1.1 12.29,29.36 13.08,28.57 C11.1 | C11.1 | 24.66,21.72 IC2.5 24.91,21.72 24,21.72 23.78,21.49 C49.1 | IC2.38 28.83,18.82 28.83,17.78 29.21,17.4 | IC1.19 9.79,34.63 C14.2 13.29,35.05 IC5.P$3 | C11.1 13.71,29.55 R15.2 | R18.2 R19.2 26.04,30.99 v25.53,30.48 | C48.1 33.22,24.08 v32.77,23.62 32.77,23.11 32.38,22.73 IC2.27 | U$2.4 28.32,7.62 v27.88,8.06 | SJ2.2 32.51,2.92 33.91,4.32 35.94,4.32 JP2.13 | v27.88,8.06 27.56,8.38 | 27.56,8.38 25.91,10.03 25.91,11.94 26.29,12.32 27.18,12.32 27.3,12.45 27.3,12.98 R1.1 | v27.88,8.06 27.24,8.06 | 27.24,8.06 27.18,8 | 27.24,8.06 27.56,8.38 | v15.88,4.32 17.16,4.32 C9.1
  Bottom 0.406: C9.1 18.12,4.2 C8.2 20.26,3.78 U$2.10 | U$2.4 30.73,7.62 31.51,8.39 C7.1 31.37,8.65 C6.2
  Bottom 0.61: C30.1 13.93,34.36 IC5.P$3 | USBVCC.2 7.02,27.72 v7.62,27.94
  Bottom 0.813: IC5.P$3 14.73,35.22 D6.2 | L4.2 21.46,35.81 C32.A v21.08,34.42
  pour 5V: 0,0 36.83,0 36.83,36.83 0,36.83
A0  (via drill 0.4)
  Top 0.254: J5.5 31.11,31.88 31.11,29.59 30.48,29.08 26.67,29.08 25.91,28.32 25.02,28.32 24.13,27.43 24.13,26.16 26.54,23.75 27.05,23.75 30.1,20.7 30.1,17.78 29.97,17.78 v29.84,17.65
  Bottom 0.203: v29.84,17.65 29.34,18.16 29.34,18.81 IC2.37
A2
  Bottom 0.254: IC2.35 30.32,18.19 30.61,17.91 31.11,17.91 32.51,16.51 J8.8 33.91,16.51 34.54,17.14 34.54,17.53 35.18,18.16 35.18,18.54 JP2.7
A3
  Bottom 0.254: IC2.34 30.85,18.8 31.37,18.8 32.38,17.78 J8.9
A4
  Bottom 0.254: IC2.33 31.84,19.73 32.51,19.05 J8.10
CFG  (via drill 0.4)
  GND 0.203: v30.86,28.57 28.45,26.16 28.45,25.91 27.56,25.02 26.67,25.02 24.26,22.61 22.61,22.61 20.45,20.45 20.45,15.62 15.37,10.54 15.37,10.29 J4.1
  Bottom 0.203: IC2.21 30.32,26.14 30.02,26.44 30.02,26.98 30.86,27.81 v30.86,28.57
  Bottom 0.254: R12.1 4.92,6.38 4.95,6.35 4.95,5.84 7.75,3.05 10.29,3.05 14.48,7.24 14.48,8.89 14.73,9.14 J4.1
CFGSW  (via drill 0.4)
  Top 0.254: v3.81,7.62 3.48,6.99 K1.1
  Bottom 0.254: R7.1 C10.2 2.09,7.97 2.29,7.97 R12.2 3.46,7.34 v3.81,7.62
D0_RX
  Bottom 0.203: IC2.9 24.28,23.73 23.75,24.26 23.75,25.02 24.13,25.4 24.13,26.16 23.5,26.8 18.03,26.8 17.27,27.56 17.27,31.24 17.02,31.5 R9.2
D1_TX  (via drill 0.4, 0.5)
  Top 0.254: v11.94,26.67 13.21,26.67 13.97,27.43 v18.29,27.43
  Bottom 0.203: IC2.10 24.42,24.23 24.13,24.51 24.13,24.89 24.51,25.27 24.51,26.42 23.75,27.18 18.67,27.18
  Bottom 0.254: R8.2 11.68,26.92 v11.94,26.67 | v18.29,27.43 18.41,27.43 18.67,27.18
D2  (via drill 0.4)
  Top 0.203: 30.61,12.83 30.61,11.27 SJ6.1 | v25.78,15.37 28.57,15.37 29.59,14.35 30.61,14.35
  Top 0.254: v25.91,27.69 25.15,27.69 24.77,27.3 24.77,26.29 26.67,24.38 27.18,24.38 30.61,20.95 30.61,14.35 30.61,12.83 33.27,10.16 J8.3
  Bottom 0.203: IC2.11 24.92,26.57 24.51,26.98 24.51,27.05 25.15,27.69 v25.91,27.69 | R1.2 26.44,14.7 v25.78,15.37
  Bottom 0.254: JP2.12 35.81,7.49 34.8,8.51 34.8,9.65 34.29,10.16 J8.3 | U$2.5 27.94,6.35 26.44,7.85 26.44,8.61 25.4,9.65 25.4,12.32 25.91,12.83 26.19,12.83 R1.2
D3  (via drill 0.4)
  Top 0.203: IC3.11 25.53,12.06 26.16,11.43 26.16,11.05 26.54,10.67 28.45,10.67 29.21,9.91 29.72,9.91 31.56,8.06 32.89,6.73 34.16,6.73 34.67,7.24 34.67,10.79 34.42,11.05 34.04,11.05 J8.4
  Top 0.254: v25.4,26.92 25.53,26.8 25.53,26.29 26.8,25.02 27.3,25.02 31.11,21.21 31.11,13.08 32.77,11.43 J8.4 | v29.84,1.91 29.84,6.35 31.56,8.06
  Bottom 0.203: IC2.12 25.68,25.62 25.4,25.91 v25.4,26.92
  Bottom 0.254: JP2.11 36.07,9.65 34.67,11.05 34.04,11.05 J8.4 | U$2.8 29.49,2.26 v29.84,1.91
D4  (via drill 0.4)
  Top 0.254: v26.21,26.75 26.42,26.54 26.42,26.16 26.92,25.65 27.43,25.65 31.62,21.46 31.62,13.34 32.26,12.7 J8.5
  Bottom 0.203: 26.29,25.66 26.29,26.67 v26.21,26.75
  Bottom 0.254: 26.29,25.66 IC2.13 | JP2.10 34.92,12.7 J8.5
D5  (via drill 0.4)
  GND 0.203: v26.8,27.43 26.8,26.54 26.67,26.42 26.67,26.29 26.54,26.16 26.29,26.16 23.88,23.75 22.23,23.75 19.3,20.83 19.3,16.38 15.37,12.45 12.57,12.45 J13.1
  Bottom 0.203: IC2.14 26.82,26.14 26.72,26.24 26.72,26.47 26.77,26.52 26.77,26.7 26.9,26.82 26.9,27.33 v26.8,27.43
  Bottom 0.254: R4.1 6.86,6.48 8.64,4.7 9.65,4.7 12.45,7.49 12.45,8.51 12.19,8.76 J13.1
D6  (via drill 0.4)
  GND 0.203: v27.3,26.42 26.67,25.78 26.42,25.78 24,23.37 22.35,23.37 19.68,20.7 19.68,16.13 15.49,11.94 13.72,11.94 J1.1
  Bottom 0.203: IC2.15 27.32,26.4 v27.3,26.42
  Bottom 0.254: R5.1 6.22,7.27 6.22,6.22 8.38,4.06 9.78,4.06 13.21,7.49 J1.1
D7  (via drill 0.4)
  GND 0.203: v26.92,28.32 28.07,27.18 28.07,26.04 27.43,25.4 26.54,25.4 24.13,22.99 22.48,22.99 20.07,20.57 20.07,15.88 15.49,11.3 14.73,11.3 J3.1
  Bottom 0.203: IC2.16 27.82,26.04 27.94,26.24 27.94,26.67 27.43,27.18 27.43,27.81 v26.92,28.32
  Bottom 0.254: R6.1 4.83,7.37 5.46,6.73 5.46,6.1 8,3.56 10.03,3.56 13.84,7.37 13.84,10.03 14.22,10.41 J3.1
D8
  Bottom 0.254: IC2.42 26.8,18.8 26.8,17.91 27.05,17.65 27.56,17.65 28.07,17.14 28.07,16 28.19,15.88 28.45,15.88 28.96,15.37 30.48,15.37 30.61,15.24 J8.7 34.16,15.24 JP2.8
D9
  Bottom 0.254: IC2.43 26.32,17.62 26.8,17.14 27.3,17.14 27.56,16.89 27.56,15.75 27.94,15.37 28.19,15.37 28.7,14.86 30.35,14.86 31.24,13.97 J8.6 35.69,13.97 JP2.9
D10  (via drill 0.4)
  GND 0.203: v30.61,26.67 29.72,26.67 27.69,24.64 26.8,24.64 24.38,22.23 22.73,22.23 20.83,20.32 20.83,8.64 19.18,6.99 J6.1
  Bottom 0.203: IC2.22 30.82,26.46 v30.61,26.67
D10_SS  (via drill 0.4)
  Bottom 0.254: IC2.44 24.92,18.82 24.64,18.54 v24.64,18.03 26.8,15.88 26.8,14.99 29.21,12.57 30.73,12.57 31.24,12.06 31.24,11.56 31.37,11.43 32,11.43 32.77,10.67 32.77,7.11 33.02,6.86 33.02,5.97 32.61,5.56 32.36,5.56 R3.2 R14.2
D11
  Bottom 0.254: IC2.23 32.02,25.02 32.26,25.02 32.26,26.16 32.51,26.42 32.51,27.81 J10.1
D11_MOSI  (via drill 0.4)
  Top 0.254: 24.13,19.56 v24.38,19.3 24,19.68 24,24.77 23.11,25.65 23.11,27.94 24.77,29.59 25.65,29.59 26.42,30.35 29.72,30.35 29.84,30.48 29.84,32.89 30.35,33.4 31.24,33.4 v32.13,34.29
  Bottom 0.254: IC2.1 24.8,19.73 v24.38,19.3 | R16.2 31.52,33.4 31.52,33.68 v32.13,34.29
D12
  Bottom 0.254: 31.75,24.26 IC2.24 32.35,24.23 32.77,24.64 32.77,25.78 33.27,26.29 33.27,26.8 J11.1
D12_MISO  (via drill 0.4)  (1 unrouted)
  Top 0.254: v31.88,26.8 32.26,27.18 32.26,29.97 32.51,30.23 33.91,30.23 34.67,30.99 35.18,30.99 35.56,31.37 35.56,31.88 JP2.2
  5V 0.254: 23.75,19.68 v23.75,18.8 | v31.88,26.8 31.88,26.16 29.97,24.38 26.29,24.38 24.51,22.61 24.51,20.45 23.81,19.75
  Bottom 0.203: v23.75,18.8 23.75,19.68 | 23.81,19.75 24.26,20.19 24.89,20.19
  Bottom 0.254: 24.89,20.19 IC2.2 | 23.75,19.68 23.81,19.75
D13_SCK  (via drill 0.4)
  Top 0.203: 23.37,17.91 23.88,18.03 24.38,18.67 24.64,18.67 25.02,19.05 25.02,19.56
  Top 0.254: v22.99,18.41 23.37,17.91 | 25.02,19.56 25.02,20.07 24.51,20.57 24.51,25.02 23.62,25.91 23.62,27.69 24.89,28.96 25.78,28.96 26.54,29.72 30.35,29.72 30.48,29.84 v30.48,30.1
  Bottom 0.203: IC2.3 24.28,20.73 22.99,19.43 v22.99,18.41
  Bottom 0.254: v30.48,30.1 30.48,30.35 31.11,30.99 R17.2
GND  (via drill 0.4, 0.6, 0.7)
  Top 0.203: v32.38,6.35 32.38,5.08 JP2.14
  Top 0.254: K1.S1 1.06,7.67 0.38,6.99 0.38,1.7 K1.S2 2.46,2.41 K1.2 | 5.28,30.41 5.39,30.41 | 5.39,30.41 v5.71,30.73 6.22,30.73 v6.35,30.86 v6.35,30.23 | 5.39,30.41 5.4,30.41 v5.71,30.1 | v9.27,30.61 9.02,30.61 8.57,30.16 | v8.64,28.57 v9.27,28.57 v9.91,28.57 | v12.7,2.41 13.32,1.79 C1.- 14.74,1.79 v14.99,2.03 15.11,2.03 v15.49,1.65 | v15.49,1.65 15.49,1.52 v15.88,1.14 | v15.49,1.65 15.24,1.4 v14.99,1.4 14.86,1.27 v14.86,0.89 | C2.2 10.4,0.62 11.05,1.27 v11.05,1.91 | 36.08,1.39 36.2,1.27 | 28.07,1.39 28.07,1.27 28.32,1.02 35.56,1.02 35.75,0.83 | v26.8,11.43 IC3.10 | IC3.15 20.45,11.18 21.97,9.65 22.99,9.65 v24.13,10.79 | 9.27,26.54 9.32,26.54 U$11.GND
  Top 0.305: U2.5 3.59,31.24 4.45,31.24 4.7,30.99
  Top 0.406: 4.7,30.99 5.28,30.41 C29.- | IC3.8 28.07,1.39 C4.1 | IC3.15 20.45,14.96 C33.1
  Top 0.61: 35.56,0.64 35.75,0.83 36.2,1.27 JP2.14
  Top 0.813: C3.2 C2.2 | C29.- 8.32,30.41 8.57,30.16 9.27,29.46 v9.27,28.57 9.27,26.54 | v2.79,3.81 2.79,2.84 K1.2
  GND 0.203: v27.56,9.65 29.08,9.65 v32.38,6.35
  GND 0.254: 26.92,20.95 v27.18,21.21 | J2.2 11.03,2.81 v11.43,2.41 | v11.05,1.91 11.05,1.76 | v2.79,3.81 2.79,3.3 5.48,0.62 10.4,0.62 11.05,1.27 v11.05,1.91 | v11.05,1.91 11.05,2.03 v11.43,2.41 | v11.43,2.41 v12.06,2.41 v12.7,2.41 | v32.38,6.35 J8.1 | v29.21,16 29.08,16 26.8,13.72 v26.8,11.43 26.16,10.79 v24.13,10.79 | v17.78,21.59 17.27,21.59 U$11.4
  Bottom 0.203: IC2.39 28.32,20.19 28.45,20.32 | v28.57,20.32 28.57,20.83 v28.83,21.08 | IC2.18 28.82,27.54 C47.2 | 28.7,16.66 28.7,16.51 v29.21,16 | 30.23,8.89 28.32,8.89 v27.56,9.65
  Bottom 0.254: C14.1 8.41,34.43 IC1.17 8.79,33.7 9.35,33.15 | 9.35,33.15 10.19,33.15 10.21,33.17 | 10.21,33.17 10.21,33.38 10.34,33.5 10.34,34 IC1.20 | IC1.24 12.29,33.7 11.84,33.25 11.84,33.22 11.63,33.02 | 11.63,33.02 12.82,33.02 IC1.26 13.74,33 13.97,32.77 15.49,32.77 15.75,33.02 15.75,33.5 C30.2 15.72,34.06 v15.49,34.29 15.49,34.8 v15.88,35.18 | 11.63,33.02 11.56,33.02 | 11.56,33.02 10.36,33.02 10.21,33.17 | 9.35,33.15 9.27,33.07 v9.27,32.89 v9.27,30.61 | 11.56,33.02 11.43,32.89 v11.43,32.77 v11.43,30.73 10.79,30.09 IC1.4 10.79,26.67 11.68,25.78 12.32,25.78 12.7,26.16 12.7,27.46 C13.1 12.69,27.59 14.23,26.05 | C49.2 23.65,22.45 23.88,22.23 IC2.6 IC2.TGND | C17.1 20.45,25.78 19.94,25.27 19.94,24.64 | 19.94,24.64 19.94,19.43 | 20.57,18.41 19.94,19.05 19.94,19.43 | 20.57,18.41 C16.1 | 19.94,24.64 19.43,24.13 | IC2.18 28.82,22.73 IC2.TGND | IC2.TGND IC2.28 32.56,22.23 33.2,22.86 33.66,22.86 34.29,23.5 34.29,23.93 C48.2 | IC2.TGND IC2.39 28.32,17.65 28.7,17.27 28.7,16.66 C50.2 | v27.18,21.21 27.3,21.21 IC2.TGND | C31.2 17.3,33.25 17.78,32.77 20.95,32.77 C32.C | C25.1 C26.1 34.39,34.01 34.54,34.16 34.54,35.81 33.91,36.45 27.56,36.45 26.8,35.69 26.8,33.15 J5.1 | J2.2 11.03,9.03 U$11.GND1 | C12.1 4.73,26.32 5.08,26.67 5.08,29.46 v5.71,30.1 | SJ1.1 34.92,1.02 35.05,0.89 | C7.2 32.14,6.59 v32.38,6.35 | C6.1 31.65,10.29 31.24,10.29 30.99,10.03 30.99,9.65 30.23,8.89 U$2.3 28.45,8.89 28.19,9.14 28.19,10.03 v26.8,11.43 | 20.57,18.41 20.57,16.89 22.86,14.61 22.86,11.68 | 22.86,11.68 21.97,10.79 | 22.86,11.68 23.24,11.68 v24.13,10.79 | 19.94,19.43 v17.78,21.59 | IC5.P$2 16.47,34.63 v17.02,35.18
  Bottom 0.254: v17.4,34.29 17.4,33.63 C31.2 | C31.2 17.05,33.27 v16.51,33.27 16.76,33.02 v16.76,32.64
  Bottom 0.406: 14.23,26.05 15.23,26.05 | 15.23,26.05 16,25.27 16,24.89 16.76,24.13 19.43,24.13 | C11.2 15.51,26.32 15.23,26.05 | C28.2 20.71,13.63 C5.1 21.08,13.21 21.97,12.32 21.97,10.79 21.97,10.67 21.46,10.16 | U$2.15 21.46,10.16 | 21.46,10.16 21.97,9.65 21.97,3.05 21.46,2.54 U$2.9 18.92,2.54 18.64,2.82 C8.1 18.12,2.4 C9.2 17.13,2.4 v15.88,1.14
  Bottom 0.61: L3.2 2.92,26.8 3.43,26.29 4.29,26.29 C12.1 | v26.29,22.73 26.54,22.73 v27.18,22.1 v27.18,21.21 | 27.3,21.21 27.94,21.21 v28.07,21.34 | v28.57,20.32 28.45,20.32 v27.43,20.32 27.43,20.95 v27.18,21.21 | v26.29,21.46 26.92,21.46 v27.18,21.21 | v26.29,20.32 v27.18,21.21 | C30.2 16.47,34.28 IC5.P$2 16.47,34.36 C31.2 | 35.26,2.21 JP2.14 35.05,0.89
  Bottom 0.813: J5.1 23.99,32.13 C18.1 23.49,32.64 C32.C | D2.A 3.81,4.83 v2.79,3.81
  pour GND: 0,0 36.83,0 36.83,36.83 0,36.83
  pour Bottom: 0,0 36.83,0 36.83,36.83 0,36.83
  pour Top: 0,0 36.83,0 36.83,36.83 0,36.83
I2C_SCL
  5V 0.254: JP2.5 36.07,25.27 34.8,26.54 34.8,28.57 32.26,31.11 32.26,32.64 31.5,33.4 29.59,33.4 J5.4
  Bottom 0.203: IC2.19 29.32,26.05 29.21,26.16 29.21,27.69 29.34,27.81 29.34,28.07 28.45,28.96 28.45,29.94 R18.1 28.7,30.1 28.96,30.35 28.96,31.24 29.34,31.62 29.34,33.66 J5.4
I2C_SDA
  5V 0.254: JP2.6 35.81,23.24 34.92,24.13 34.92,25.65 34.29,26.29 34.29,28.32 31.62,30.99 29.46,30.99 J5.3
  Bottom 0.203: IC2.20 29.82,26.08 29.69,26.21 29.69,26.24 29.64,26.34 29.64,27.48 29.72,27.56 29.72,29.84 29.34,30.23 29.34,30.99 29.72,31.37 29.72,34.8 28.83,35.69 27.81,35.69 27.3,35.18 27.3,33.15 J5.3 28.32,31.02 R19.1 28.42,30.86
MAX232_V+
  Top 0.406: C21.1 17.66,9.64 20.45,6.86 IC3.2
MOSI
  5V 0.254: JP2.3 36.07,29.97 34.67,31.37 34.67,33.4 J5.8
  Bottom 0.254: J5.8 33.4,33.56 C25.2 R16.1
N$1
  Top 0.406: C19.1 21.35,1.66 21.72,2.03 IC3.3
N$2
  Bottom 0.254: C15.2 16.06,30.61 FTDI-RESET.1
N$3  (via drill 0.4)
  Top 0.254: D5.B 7.43,8.26 5.08,8.26 4.83,8.51 v4.83,9.27
  Bottom 0.254: v4.83,9.27 R6.2
N$4  (via drill 0.8, 0.9)
  Top 0.813: L1.1 8.13,3.06 C3.1 8.11,1.91 6.99,1.91 6.86,1.78 | D1.C 6.11,1.02 6.86,1.78 | v5.46,2.92 5.59,2.92 6.22,2.29 6.35,2.29 6.86,1.78
  5V 0.813: v3.81,17.78 3.81,15.24 3.17,14.61 3.17,9.27 2.54,8.64 2.54,5.84 v5.46,2.92
  Bottom 0.813: D2.C 3.81,1.27 v5.46,2.92 | D7.C 4.83,18.8 v3.81,17.78
N$5  (via drill 0.4)
  Top 0.254: D5.G 7.43,9.02 6.1,9.02 v5.84,9.27
  Bottom 0.254: v5.84,9.27 R5.2
N$6
  Bottom 0.61: F1.2 2.54,29.72 D4.2 3.56,28.7 4.32,27.94 C12.2
N$7  (via drill 0.6)
  Top 0.406: v1.91,34.42 2.54,33.78 3.53,33.78 U2.1
  Bottom 0.406: F1.1 2.54,35.05 v1.91,34.42
N$8
  Bottom 0.203: Y1.2 21.46,22.61 21.84,22.99 22.99,22.99 23.04,23.04 | 23.04,23.04 23.88,23.04 24.21,22.71 24.9,22.71 IC2.7 | 22.63,25.63 22.86,25.4 22.86,23.22 23.04,23.04
  Bottom 0.254: R13.2 22.63,25.63 | Y1.2 21.46,19.56 21.97,19.05 21.97,18.51 C16.2
N$9
  Top 0.406: IC3.5 24.26,1.53 C20.1
N$10
  Bottom 0.254: J14.1 J5.6
N$11
  Top 0.406: IC3.4 22.99,1.28 C20.2
N$12
  Bottom 0.203: C17.2 21.69,26.13 21.97,26.42 23.19,26.42 23.32,26.29 23.32,25.93 R13.1 23.37,25.68 23.37,23.62 23.5,23.5 24,23.5 24.27,23.23 IC2.8
  Bottom 0.254: C17.2 21.69,24.48 Y1.1
N$13
  Top 0.813: D1.A 9.12,5.33 J2.1
N$15  (via drill 0.4)
  Top 0.254: D5.R 7.23,7.37 7.87,7.37 8.51,8 v8.51,8.64
  Bottom 0.254: v8.51,8.64 8.48,8.61 R4.2
N$16  (via drill 0.4)
  Top 0.254: U2.3 4.57,32.51 4.95,32.13 v5.21,32
  Bottom 0.254: R10.2 6.63,32.26 6.48,32.26 5.97,31.75 Z1.1 5.6,31.73 v5.21,32
N$17  (via drill 0.4)
  Top 0.254: U2.2 3.58,33.15 4.57,33.15 v5.21,33.78
  Bottom 0.254: v5.21,33.78 5.45,34.02 Z2.1 5.97,34.16 6.35,34.54 6.63,34.54 R11.2
N$18
  Bottom 0.254: IC1.31 13.76,30.5 C15.1
N$19
  Bottom 0.813: L4.1 25.18,35.34 | 25.18,35.34 25.78,34.73 J5.2 | C18.2 24.91,35.34 25.18,35.34
N$20
  Top 0.203: IC3.12 24.26,14.1 24.77,14.61 28.57,14.61 28.96,14.22 28.96,11.91 SJ6.2
N$21  (via drill 0.4)
  Top 0.254: U2.S1 3.73,35.56 5.08,35.56 5.46,35.94 v5.59,35.94 5.59,35.7 Z2.2 5.97,33.15 5.71,32.89 v5.21,32.89
  Top 0.61: U2.S1 3.23,36.07 1.91,36.07 1.57,35.74 U2.S2 0.64,34.54 0.31,34.22 U2.S3 0.76,33.06 0.76,32.13 0.31,31.68 U2.S4 0.31,30.68 0.64,30.35 U2.S5 0.81,29.11 U2.S6
  Bottom 0.254: v5.59,35.94 5.97,35.56 Z2.2 | Z1.2 5.83,32.89 v5.21,32.89
  Bottom 0.406: L3.1 0.91,29.02 U2.S5
N$25
  Bottom 0.254: IC2.29 32,21.73 32,21.72 32.89,21.72 33.66,20.95 J12.1
N$30
  Bottom 0.254: R2.1 9.49,21.91 SJ5.1
N$31
  Bottom 0.254: U$2.7 30.48,3.81 30.86,4.19 31.14,4.19 R14.1 31.46,4.38 SJ2.1
N$32
  Bottom 0.254: R3.1 30.86,5.46 30.48,5.08 U$2.6 29.36,4.95 28.32,4.95 27.69,4.32 27.69,1.65 28.32,1.02 SJ1.2
N$35
  Bottom 0.406: C28.1 18.91,13.63 C5.2 19.33,12.39 U$2.16
N$47
  Top 0.406: IC3.1 19.18,1.51 C19.2
N$49
  Top 0.406: IC3.6 25.53,2.16 25.91,1.78 25.91,1.26 C4.2
RD+
  Bottom 0.254: IC1.14 7.86,32.5 7.62,32.26 7.62,32.13 7.14,31.65 R10.1
RD-
  Bottom 0.254: IC1.15 7.89,33 7.62,33.27 7.62,33.66 7.49,33.78 7.14,33.78 R11.1
RESET  (via drill 0.4)
  Top 0.254: v23.24,20.57 22.99,20.32 20.95,20.32 17.14,24.13 | v31.24,27.3 31.37,27.43 31.5,27.43 31.75,27.69 31.75,30.23 32.26,30.73 33.66,30.73 34.54,31.62 34.54,32.77 35.94,34.16 35.94,34.54 JP2.1 | 17.14,24.13 17.14,25.4 v16.51,26.04 | 17.14,24.13 14.48,24.13 14.1,24.51 10.67,24.51 8,21.84 4.95,21.84 2.29,19.18 2.29,12.19 v1.65,11.56
  5V 0.254: v31.24,27.3 31.24,26.29 30.99,26.04 30.86,26.04 29.72,24.89 26.04,24.89 24,22.86 24,21.34 v23.24,20.57
  Bottom 0.203: 24.91,21.21 24.26,21.21 23.75,20.7 23.37,20.7 v23.24,20.57
  Bottom 0.254: 24.91,21.21 IC2.4 | R15.1 16.07,29.72 FTDI-RESET.2 16.51,29.65 v16.51,26.04 | v1.65,11.56 2.54,10.67 2.54,9.5 C10.1
RJ45_VIN
  Bottom 0.254: D7.A 11.18,18.8 U$11.5
RS232_RX
  Top 0.203: U$11.6 14.99,16.51 15.75,15.75 17.91,15.75 18.67,16.51 20.83,16.51 21.84,15.49 21.84,14.86 22.99,13.72 IC3.13
RS232_TX
  Top 0.203: U$11.3 12.19,19.81 13.34,18.67 13.34,18.54 13.59,18.29 13.59,17.27 13.34,17.02 13.34,16 13.59,15.75 13.59,15.62 13.97,15.24 18.03,15.24 18.8,16 20.7,16 21.21,15.49 21.21,14.48 21.72,13.97 IC3.14
RX+  (via drill 0.4)
  Top 0.254: v15.37,23.24 12.57,23.24 U$11.1
  Bottom 0.254: U$11.1 10.54,21.21 R2.2 10.41,21.18 10.41,20.57 10.16,20.32 9.53,20.32 9.27,20.07 9.27,16.23 SJ4.1 | U$2.14 19.18,8.89 18.67,9.4 18.67,10.41 16.76,12.32 16.76,21.84 v15.37,23.24
RX-
  Bottom 0.254: SJ5.2 10.32,23.65 | SJ3.1 9.49,13.87 8.64,14.73 8.64,24.13 8.89,24.38 9.59,24.38 10.32,23.65 | 10.32,23.65 11.05,24.38 13.34,24.38 14.1,23.62 14.1,22.23 U$11.2 16.13,20.19 16.13,12.06 18.16,10.03 18.16,8.38 18.8,7.87 U$2.13
SCLK
  5V 0.254: JP2.4 35.81,28.32 34.04,30.1 34.04,30.13 33.43,30.73 33.43,32.1 J5.7
  Bottom 0.254: J5.7 33.43,32.1 C26.2 R17.1
TX+
  Bottom 0.254: SJ4.2 11.43,16 U$11.7 12.95,14.48 12.95,13.72 13.46,13.21 13.46,12.95 17.02,9.4 17.02,6.35 18.29,5.08 U$2.11
TX-  (via drill 0.4)
  Top 0.254: v11.43,13.34 14.1,13.34 U$11.8
  Bottom 0.254: SJ3.2 10.45,13.59 11.18,13.59 v11.43,13.34 | U$2.12 19.18,6.35 18.8,5.97 18.29,5.97 17.65,6.6 17.65,9.65 14.86,12.45 14.86,13.84 U$11.8
USBRXD
  Bottom 0.254: IC1.30 13.22,31 13.46,31.24 13.62,31.24 R9.1
USBTXD
  Bottom 0.254: R8.1 11.56,28.7 11.81,28.96 11.81,29.43 IC1.2
USBVCC
  Bottom 0.61: D4.1 5.97,27.4 USBVCC.1
VIN  (via drill 0.9)
  Top 0.813: C2.1 10.02,2.03 L1.2 10.16,3.32 10.16,3.81 12.94,6.59 C1.+ 15.48,6.59 v15.88,6.99
  5V 0.813: IC5.P$1 19.01,28.24 19.94,27.3 19.94,21.84 17.78,19.94 17.78,13.59 15.88,11.43 v15.88,6.99
  Bottom 0.61: C31.1 19.01,34.28 IC5.P$1
  Bottom 0.813: IC5.P$1 18.16,35.26 D6.1

### Text on the board
_bsilk: 5V | SCL | NA | MOSI | R | GND | SDA | A0 | SKAARDUINO-SER V1.0 | SKAARHOJ 2016 | GND | DC-IN